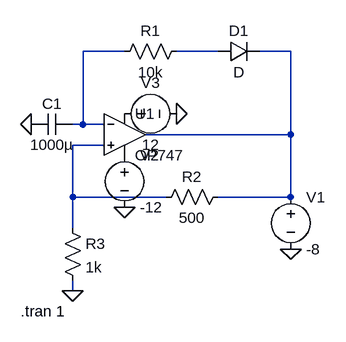
[diagram p0: schematic Oscilador con  FETs en realimentacion.asc]
Oscilador con  FETs en realimentacion.asc, the LTspice schematic file:
Version 4
SHEET 1 880 680
WIRE 160 48 96 48
WIRE 304 48 240 48
WIRE 416 48 368 48
WIRE 96 160 96 48
WIRE 96 160 80 160
WIRE 128 160 96 160
WIRE 416 176 416 48
WIRE 416 176 192 176
WIRE 128 192 80 192
WIRE 80 272 80 192
WIRE 224 272 80 272
WIRE 416 272 416 176
WIRE 416 272 304 272
WIRE 80 320 80 272
WIRE 80 416 80 400
FLAG 16 160 0
FLAG 80 416 0
FLAG 416 352 0
FLAG 160 288 0
FLAG 240 144 0
SYMBOL OpAmps\\OP747 160 112 R0
SYMATTR InstName U1
SYMBOL cap 80 144 R90
WINDOW 0 0 32 VBottom 2
WINDOW 3 32 32 VTop 2
SYMATTR InstName C1
SYMATTR Value 1000µ
SYMBOL res 256 32 R90
WINDOW 0 0 56 VBottom 2
WINDOW 3 32 56 VTop 2
SYMATTR InstName R1
SYMATTR Value 10k
SYMBOL voltage 416 256 R0
WINDOW 123 0 0 Left 0
WINDOW 39 0 0 Left 0
SYMATTR InstName V1
SYMATTR Value -8
SYMBOL res 320 256 R90
WINDOW 0 0 56 VBottom 2
WINDOW 3 32 56 VTop 2
SYMATTR InstName R2
SYMATTR Value 500
SYMBOL res 64 304 R0
SYMATTR InstName R3
SYMATTR Value 1k
SYMBOL voltage 160 192 R0
WINDOW 123 0 0 Left 0
WINDOW 39 0 0 Left 0
SYMATTR InstName V2
SYMATTR Value -12
SYMBOL voltage 144 144 R270
WINDOW 0 32 56 VTop 2
WINDOW 3 -32 56 VBottom 2
WINDOW 123 0 0 Left 0
WINDOW 39 0 0 Left 0
SYMATTR InstName V3
SYMATTR Value 12
SYMBOL diode 304 64 R270
WINDOW 0 32 32 VTop 2
WINDOW 3 0 32 VBottom 2
SYMATTR InstName D1
TEXT 0 448 Left 2 !.tran 1

The netlist it stands for:
* Oscilador con  FETs en realimentacion.asc
XU1 N004 N001 P001 P002 N003 OP747  ; pins In+ In- V+ V- OUT
C1 N001 0 1000µ
R1 N002 N001 10k
V1 N003 0 -8
R2 N003 N004 500
R3 N004 0 1k
V2 P002 0 -12
V3 P001 0 12
D1 N002 N003 D
.model D D
.lib standard.dio
.tran 1
.backanno
.end